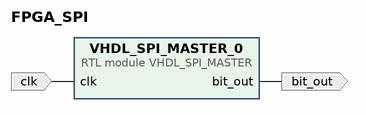
[diagram p0: block diagram of the top level]
# Vivado block design FPGA_SPI, xc7z020clg484-1, Vivado 2024.1
create_bd_design FPGA_SPI

create_bd_port -dir I -type clk clk
set_property -dict {CONFIG.FREQ_HZ 100000000} [get_bd_ports clk]
create_bd_port -dir O bit_out

create_bd_cell -type module -reference VHDL_SPI_MASTER VHDL_SPI_MASTER_0

# ---- connections ----

connect_bd_net [get_bd_pins VHDL_SPI_MASTER_0/bit_out] [get_bd_ports bit_out]
connect_bd_net [get_bd_ports clk] [get_bd_pins VHDL_SPI_MASTER_0/clk]

validate_bd_design
save_bd_design
